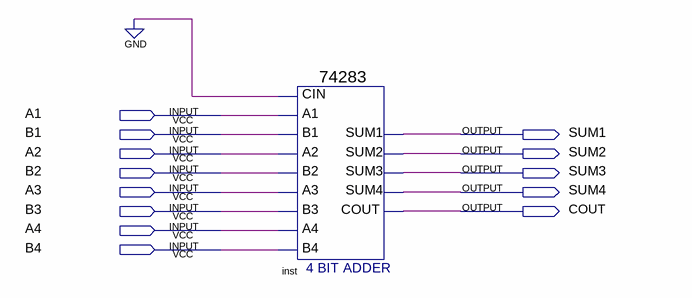
[diagram p0: schematic sheet]
// Quartus schematic test_74283.bdf as structural Verilog: 1 symbols, 13 pins
module test_74283 (
  input  A1,
  input  B1,
  input  A2,
  input  B2,
  input  A3,
  input  B3,
  input  A4,
  input  B4,
  output SUM1,
  output SUM2,
  output SUM3,
  output SUM4,
  output COUT
);

  \74283  inst (
    .CIN(1'b0), .A1(A1), .A2(A2), .B2(B2), .A3(A3), .A4(A4), .B4(B4), .B1(B1), .B3(B3), .SUM4(SUM4),
    .COUT(COUT), .SUM1(SUM1), .SUM2(SUM2), .SUM3(SUM3));
endmodule
